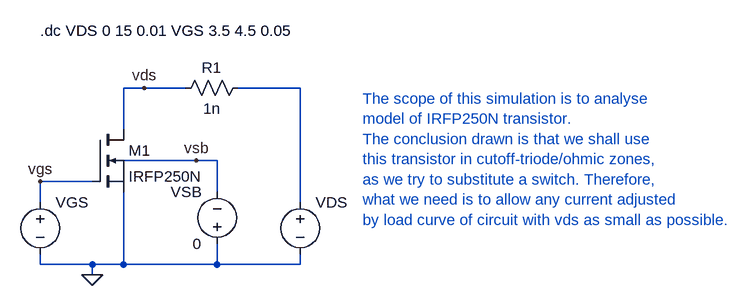
[diagram p0: schematic IRFP_Mosfet_Output_characteristic_analysis.asc]
IRFP_Mosfet_Output_characteristic_analysis.asc, the LTspice schematic file:
Version 4
SHEET 1 1256 680
WIRE 80 0 48 0
WIRE 144 0 80 0
WIRE 320 0 224 0
WIRE 48 64 48 0
WIRE 160 112 48 112
WIRE 192 112 160 112
WIRE 0 144 -80 144
WIRE 192 160 192 112
WIRE -80 176 -80 144
WIRE 320 176 320 0
WIRE -80 272 -80 256
WIRE 0 272 -80 272
WIRE 48 272 48 160
WIRE 48 272 0 272
WIRE 192 272 192 240
WIRE 192 272 48 272
WIRE 320 272 320 256
WIRE 320 272 192 272
WIRE 0 288 0 272
FLAG 0 288 0
FLAG -80 144 vgs
FLAG 80 0 vds
FLAG 160 112 vsb
SYMBOL voltage -80 160 R0
WINDOW 3 24 96 Invisible 2
WINDOW 123 0 0 Left 0
WINDOW 39 0 0 Left 0
SYMATTR Value 0
SYMATTR InstName VGS
SYMBOL voltage 320 160 R0
WINDOW 3 24 96 Invisible 2
WINDOW 123 0 0 Left 0
WINDOW 39 0 0 Left 0
SYMATTR Value 12
SYMATTR InstName VDS
SYMBOL voltage 192 256 R180
WINDOW 0 24 96 Left 2
WINDOW 3 24 16 Left 2
SYMATTR InstName VSB
SYMATTR Value 0
SYMBOL res 240 -16 R90
WINDOW 0 0 56 VBottom 2
WINDOW 3 32 56 VTop 2
SYMATTR InstName R1
SYMATTR Value 1n
SYMBOL nmos 0 64 R0
SYMATTR InstName M1
SYMATTR Value IRFP250N
TEXT -80 -88 Left 2 !.dc VDS 0 15 0.01 VGS 3.5 4.5 0.05
TEXT 416 16 Left 2 ;The scope of this simulation is to analyse\nmodel of IRFP250N transistor.\nThe conclusion drawn is that we shall use\nthis transistor in cutoff-triode/ohmic zones,\nas we try to substitute a switch. Therefore,\nwhat we need is to allow any current adjusted\nby load curve of circuit with vds as small as possible.

The netlist it stands for:
* IRFP_Mosfet_Output_characteristic_analysis.asc
VGS vgs 0 0
VDS N001 0 12
VSB 0 vsb 0
R1 N001 vds 1n
M1 vds vgs 0 0 IRFP250N
.model NMOS NMOS
.model PMOS PMOS
.lib standard.mos
.dc VDS 0 15 0.01 VGS 3.5 4.5 0.05
* The scope of this simulation is to analyse
* model of IRFP250N transistor.
* The conclusion drawn is that we shall use
* this transistor in cutoff-triode/ohmic zones,
* as we try to substitute a switch. Therefore,
* what we need is to allow any current adjusted
* by load curve of circuit with vds as small as possible.
.backanno
.end